# Altium schematic sheet HV_boost.SchDoc
size A4; DocumentNumber: 4; SheetNumber: 4; SheetTotal: 10
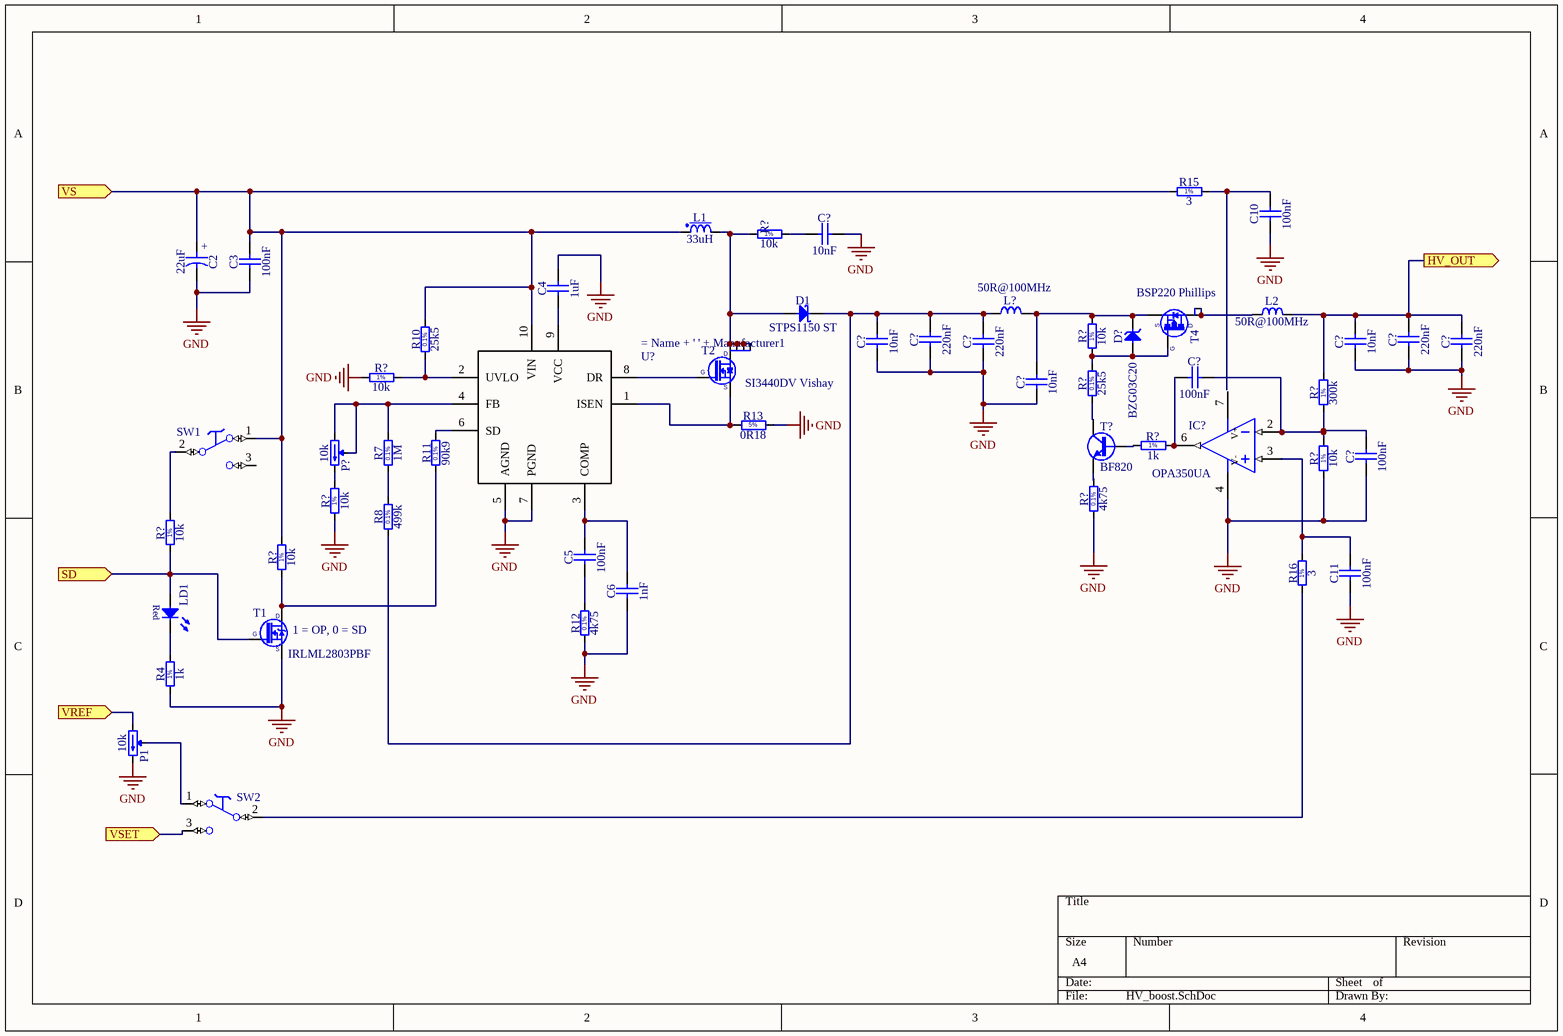
[diagram p0: HV_boost.SchDoc]

## Parts
(Parts that share a designator on the sheet are numbered #1, #2 ... from top to bottom, then left to right.)
=_Name_+_'_'_+_Manufacturer1  U?  [SOP50P490X110-10N]
C2  22uF  [CAPAE530X540N]
C3  100nF  [CAPC2012X135N]
C4  1uF  [CAPC2012X135N]
C5  100nF  [CAPC2012X135N]
C6  1nF  [CAPC2012X135N]
C10  100nF  [CAPC2012X135N]
C11  100nF  [CAPC2012X135N]
C?#1  10nF  [CAPC3216X100N]
C?#2  220nF  [CAPR500-350X720X850]
C?#3  220nF  [CAPR500-350X720X850]
C?#4  10nF  [CAPC3216X100N]
C?#5  220nF  [CAPR500-350X720X850]
C?#6  10nF  [CAPC3216X100N]
C?#7  220nF  [CAPR500-350X720X850]
C?#8  100nF  [CAPC2012X135N]
C?#9  10nF  [CAPC3216X100N]
C?#10  100nF  [CAPC2012X135N]
D1  STPS1150 ST  [DIOM5027X244N]
D?  BZG03C20  [DIOM5326X230N]
IC?  OPA350UA  [SOIC127P600X175-8N]
L1  33uH  [IND_PANASONIC_ELL6RH]
L2  50R@100MHz  [IND_MURATA_BLM31PG]
L?  50R@100MHz  [IND_MURATA_BLM31PG]
LD1  Super Red  [LED_OSRAM_LSR976]  (value not drawn)
P1  10k  [TRIM_BOURNS_3266W]
P?  10k  [TRIM_BOURNS_3266W]
R4  1k  [RESC2012X60N]
R7  1M  [RESC2012X60N]
R8  499k  [RESC2012X60N]
R10  25k5  [RESC2012X60N]
R11  90k9  [RESC2012X60N]
R12  4k75  [RESC2012X60N]
R13  0R18  [RESC2012X70N]
R15  3  [RESC2012X60N]
R16  3  [RESC2012X60N]
R?#1  10k  [RESC2012X60N]
R?#2  10k  [RESC2012X60N]
R?#3  10k  [RESC2012X60N]
R?#4  25k5  [RESC2012X60N]
R?#5  300k  [RESC2012X60N]
R?#6  1k  [RESC2012X60N]
R?#7  10k  [RESC2012X60N]
R?#8  10k  [RESC2012X60N]
R?#9  4k75  [RESC2012X60N]
R?#10  10k  [RESC2012X60N]
R?#11  10k  [RESC2012X60N]
SW1  Switch  [SW_TYCO_1-1437575-4]  (value not drawn)
SW2  Switch  [SW_TYCO_1-1437575-4]  (value not drawn)
T1  IRLML2803PBF  [SOT95P237X112-3N]
T2  SI3440DV Vishay  [SOT95P280X110-6N]
T4  BSP220 Phillips  [SOT230P700X175-4N]
T?  BF820  [SOT95P230X110-3N]

## Ports
HV_OUT (out), SD (in), VREF (in), VS (in), VSET (in)

## Nets
GND: =_Name_+_'_'_+_Manufacturer1.5(AGND) =_Name_+_'_'_+_Manufacturer1.7(PGND) C2.2 C3.1 C4.2 C6.1 C10.1 C11.1 C?#1.2 C?#2.1 C?#3.1 C?#4.1 C?#5.1 C?#6.1 C?#7.1 C?#9.1 C?#10.1 IC?.4(V-) P1.3(CW) R4.1 R12.1 R13.2 R?#3.1 R?#7.1 R?#8.1 R?#9.1 T1.2(S)
HV_OUT: C?#3.2 C?#6.2 C?#7.2 L2.2 R?#5.2 ; port HV_OUT
SD: LD1.2(A) R?#10.1 T1.1(G) ; port SD
VREF: P1.1(CCW) ; port VREF
VS: =_Name_+_'_'_+_Manufacturer1.10(VIN) C2.1 C3.2 L1.1 R10.2 R15.1 R?#11.2 SW1.1(NC) ; port VS
VSET: SW2.3(NO) ; port VSET
Net=_Name_+_'_'_+_Manufacturer1_1: =_Name_+_'_'_+_Manufacturer1.1(ISEN) R13.1 T2.4(S)
Net=_Name_+_'_'_+_Manufacturer1_2: =_Name_+_'_'_+_Manufacturer1.2(UVLO) R10.1 R?#3.2
Net=_Name_+_'_'_+_Manufacturer1_3: =_Name_+_'_'_+_Manufacturer1.3(COMP) C5.2 C6.2
Net=_Name_+_'_'_+_Manufacturer1_4: =_Name_+_'_'_+_Manufacturer1.4(FB) P?.1(CCW) P?.2(W) R7.2
Net=_Name_+_'_'_+_Manufacturer1_6: =_Name_+_'_'_+_Manufacturer1.6(SD) R11.2
Net=_Name_+_'_'_+_Manufacturer1_8: =_Name_+_'_'_+_Manufacturer1.8(DR) T2.3(G)
Net=_Name_+_'_'_+_Manufacturer1_9: =_Name_+_'_'_+_Manufacturer1.9(VCC) C4.1
NetC5_1: C5.1 R12.2
NetC10_2: C10.2 R15.2
NetC11_2: C11.2 IC?.3(IN+) R16.2
NetC?#1_1: C?#1.1 R?#1.2
NetC?#2_2: C?#2.2 C?#4.2 C?#5.2 D1.1(C) L?.1 R8.1
NetC?#8_1: C?#8.1 IC?.6(OUT) R?#6.2
NetC?#8_2: C?#8.2 C?#10.2 IC?.2(IN-) R?#5.1 R?#7.2
NetC?#9_2: C?#9.2 D?.1(C) L?.2 R?#2.2 T4.3(S)
NetD1_2: D1.2(A) L1.2 R?#1.1 T2.1(D) T2.2(D) T2.5(D) T2.6(D)
NetD?_2: D?.2(A) R?#2.1 R?#4.2 T4.1(G)
NetL2_1: L2.1 T4.2(D) T4.4(D)
NetLD1_1: LD1.1(C) R4.2
NetP1_2: P1.2(W) SW2.1(NC)
NetP?_3: P?.3(CW) R?#8.2
NetR7_1: R7.1 R8.2
NetR11_1: R11.1 R?#11.1 T1.3(D)
NetR16_1: R16.1 SW2.2(C)
NetR?#4_1: R?#4.1 T?.3(C)
NetR?#6_1: R?#6.1 T?.1(B)
NetR?#9_2: R?#9.2 T?.2(E)
NetR?#10_2: R?#10.2 SW1.2(C)

Not connected (* = marked no-connect by the designer): IC? 7(V+); SW1 3(NO)

## Notes on the sheet
- (near T1) 1 = OP, 0 = SD
- (in symbol CAE530-540_22UF_16V_20%) +
- (in symbol LED_OSRAM_LSR976) Red
- (in symbol R0805_0R18_5%_0.25W_250PPM_PANASONIC_ERJ) 5%
- (in symbol R0805_1K_1%_0.33W_100PPM_VISHAY_CRCW-HP) 1%
- (in symbol R0805_1M_0.1%_0.1W_25PPM) 0.1%
- (in symbol R0805_3R_1%_0.125W_200PPM) 1%
- (in symbol R0805_4K75_0.1%_0.1W_10PPM) 0.1%
- (in symbol R0805_10K_1%_0.125W_100PPM) 1%
- (in symbol R0805_25K5_0.1%_0.1W_10PPM) 0.1%
- (in symbol R0805_90K9_0.1%_0.1W_10PPM) 0.1%
- (in symbol R0805_300K_1%_0.125W_100PPM) 1%
- (in symbol R0805_499K_0.1%_0.25W_25PPM_150V) 0.1%

## Library data of the parts
=_Name_+_'_'_+_Manufacturer1 = LM3418: Manufacutrer: TI; Name: LM3418
C2 = CAE530-540_22UF_16V_20%: Polarised capacitor; Part Description: Aluminum Electrolytic SMT Capacitor; Manufacturer: PANASONIC; Manufacturer Part Number: EEEFK1C220AR; Voltage: 16V; Tolerance: ±20%; Part Number: CAE530-540_22UF_16V_20%; Component Kind: Standard; Component Type: Standard; Pin Count: 2; Value: 22uF; Status: Not Recommended; Case: B; Mounted: Yes; Socket: No; SMD: Yes; Sense: No; ComponentHeight: 5.8mm; HelpURL: \\cern.ch\dfs\Applications\Altium\Datasheets\CAE_PANASONIC_FK.pdf; Author: CERN DEM JLC; CreateDate: 03.12.2007; LatestRevisionDate: 05.11.2014
C3 C5 C10 C11 C?#8 C?#10 = CC0805_100NF_50V_10%_X7R: Non-polarised capacitor; Part Description: SMD Multilayer Chip Ceramic Capacitor; Manufacturer: GENERIC; Manufacturer1 Part Number: C2012X7R1H104K085AA; Voltage: 50V; TC: X7R; Tolerance: ±10%; Part Number: CC0805_100NF_50V_10%_X7R; Component Kind: Standard; Component Type: Standard; Pin Count: 2; Value: 100nF; Status: Preferred; Manufacturer Part Number: CC0805_100NF_50V_10%_X7R; Case: 0805; Mounted: Yes; Socket: No; SMD: Yes; Sense: No; Manufacturer1 Example: TDK; Manufacturer1 ComponentHeight: 1mm; HelpURL: \\cern.ch\dfs\Applications\Altium\Datasheets\CC0805_X7R_TDK_C.pdf; Author: CERN DEM JLC; CreateDate: 03.12.2007; LatestRevisionDate: 22.04.2015
C4 = CC0805_1UF_16V_10%_X7R: Non-polarised capacitor; Part Description: SMD Multilayer Chip Ceramic Capacitor; Manufacturer: GENERIC; Manufacturer1 Part Number: C2012X7R1C105K125AA; Voltage: 16V; TC: X7R; Tolerance: ±10%; Part Number: CC0805_1UF_16V_10%_X7R; Component Kind: Standard; Component Type: Standard; Pin Count: 2; Value: 1uF; Status: Preferred; Manufacturer Part Number: CC0805_1UF_16V_10%_X7R; Case: 0805; Mounted: Yes; Socket: No; SMD: Yes; Sense: No; Manufacturer1 Example: TDK; Manufacturer1 ComponentHeight: 1.45mm; HelpURL: \\cern.ch\dfs\Applications\Altium\Datasheets\CC0805_X7R_TDK_C.pdf; Author: CERN DEM JLC; CreateDate: 03.12.2007; LatestRevisionDate: 22.04.2015
C6 = CC0805_1NF_50V_10%_X7R: Non-polarised capacitor; Part Description: SMD Multilayer Chip Ceramic Capacitor; Manufacturer: GENERIC; Manufacturer1 Part Number: 223858015623; Voltage: 50V; TC: X7R; Tolerance: ±10%; Part Number: CC0805_1NF_50V_10%_X7R; Component Kind: Standard; Component Type: Standard; Pin Count: 2; Value: 1nF; Status: Preferred; Manufacturer Part Number: CC0805_1NF_50V_10%_X7R; Case: 0805; Mounted: Yes; Socket: No; SMD: Yes; Sense: No; Manufacturer1 Example: PHYCOMP; Manufacturer1 ComponentHeight: 1.35mm; HelpURL: \\cern.ch\dfs\Applications\Altium\Datasheets\CC0805_X7R_PHYCOMP.pdf; Author: CERN DEM JLC; CreateDate: 03.12.2007; LatestRevisionDate: 22.04.2015
C?#1 C?#4 C?#6 C?#9 = CC1206_10NF_200V_5%_C0G: Non-polarised capacitor; Part Description: SMD Multilayer Chip Ceramic Capacitor; Manufacturer: GENERIC; Manufacturer1 Part Number: C1206C103J2GACAUTO; Voltage: 200V; TC: C0G/NP0; Tolerance: ±5%; Part Number: CC1206_10NF_200V_5%_C0G; Component Kind: Standard; Component Type: Standard; Pin Count: 2; Value: 10nF; Status: Preferred; Manufacturer Part Number: CC1206_10NF_200V_5%_C0G; Case: 1206; Mounted: Yes; Socket: No; SMD: Yes; Sense: No; Manufacturer1 Example: KEMET; Manufacturer1 ComponentHeight: 1.0mm; HelpURL: \\cern.ch\dfs\Applications\Altium\Datasheets\CC1206_C0G_KEMET.pdf; Author: CERN DEM JLC; CreateDate: 25.11.2014; LatestRevisionDate: 25.11.2014
C?#2 C?#3 C?#5 C?#7 = CPER_220NF_100V_10%_500-350X720X850: Non-polarised capacitor; Part Description: Metallized Polyester Film Capacitor (MKS2); Manufacturer: WIMA; Manufacturer Part Number: MKS2D032201C00KSSD; Voltage: 100VDC/63VAC; Tolerance: ±10%; Part Number: CPER_220NF_100V_10%_500-350X720X850; Component Kind: Standard; Component Type: Standard; Pin Count: 2; Value: 220nF; Status: None; Case: LS5 W3.5 x L7.2 x H8.5; Mounted: Yes; Socket: No; SMD: No; Sense: No; ComponentHeight: 8.5mm; HelpURL: \\cern.ch\dfs\Applications\Altium\Datasheets\CPER_WIMA_MKS2.pdf; Author: CERN DEM JLC; CreateDate: 22.03.2010; LatestRevisionDate: 30.01.2012
D1 = STPS1150: Diode Schottky  Anode Pin 1 Cathode Pin 3 (Pas de pin 2); Name: STPS1150; Manufacturer: ST
D? = BZG03C20: Zener Diode; Part Description: Voltage Regulator Diode; Manufacturer: VISHAY SEMICONDUCTOR; Voltage: 20V; Power: 1.25W; PressFit: No; Bonding: No; Part Number: BZG03C20; Component Kind: Standard; Component Type: Standard; Device: BZG03C20; PackageDescription: DO-214-AC/SMA Molded Diode, Body 5.3x2.6mm, IPC Medium Density; Manufacturer Part Number: BZG03C20; Pin Count: 2; Case: DO-214AC; Mounted: Yes; Socket: No; SMD: Yes; Sense: No; ComponentHeight: 2.3mm; HelpURL: \\cern.ch\dfs\Applications\Altium\Datasheets\BZG03C.pdf; Author: CERN DEM JLC; CreateDate: 02.06.2008; LatestRevisionDate: 02.06.2008
IC? = OPA350UA: Operational Amplifier; Part Description: High-Speed, Single-Supply, Rail-to-Rail Operational Amplifier; Manufacturer: TEXAS INSTRUMENTS; PressFit: No; Bonding: No; Part Number: OPA350UA; Component Kind: Standard; Component Type: Standard; Device: OPA350UA; PackageDescription: SOIC 8, Pitch 1.27mm - Body 4x5mm, IPC Medium Density; Manufacturer Part Number: OPA350UA; Pin Count: 5; Case: SOIC8; Mounted: Yes; Socket: No; SMD: Yes; Sense: No; ComponentHeight: 1.75mm; Author: CERN DEM JLC; HelpURL: \\cern.ch\dfs\Applications\Altium\Datasheets\OPA350UA.pdf; CreateDate: 11.10.2012; LatestRevisionDate: 11.10.2012
L1 = IND_33UH_20%_PANASONIC_ELL6RH330M: Inductor With Magnetic core 1Dot; Part Description: SMD Choke Coil; Power: 600mA; Resistance: 0.38R; Tolerance: ±20%; Part Number: IND_33UH_20%_PANASONIC_ELL6RH330M; Component Kind: Standard; Component Type: Standard; Pin Count: 2; Value: 33uH; Status: None; Manufacturer: PANASONIC; Manufacturer Part Number: ELL6RH330M; Mounted: Yes; Socket: No; SMD: Yes; Sense: No; ComponentHeight: 2.8mm; HelpURL: \\cern.ch\dfs\Applications\Altium\Datasheets\IND_PANASONIC_ELL6RH.pdf; Author: CERN DEM JMW; CreateDate: 09.01.2009; LatestRevisionDate: 09.01.2009
L2 L? = IND1206_MURATA_BLM31PG500SN1: Inductor; Part Description: SMD EMIFIL Chip Ferrite Bead; Manufacturer: MURATA; Power: 3.5A; Resistance: 0.015R; Part Number: IND1206_MURATA_BLM31PG500SN1; Component Kind: Standard; Component Type: Standard; Pin Count: 2; Value: 50R@100MHz; Status: None; Manufacturer Part Number: BLM31PG500SN1; Case: 1206; Mounted: Yes; Socket: No; SMD: Yes; Sense: No; ComponentHeight: 1.3mm; HelpURL: \\cern.ch\dfs\Applications\Altium\Datasheets\IND1206_MURATA_BLM31P.pdf; Author: CERN DEM JLC; CreateDate: 05.12.2013; LatestRevisionDate: 05.12.2013
LD1 = LED_OSRAM_LSR976: LED Red 1C 2A; Part Description: Surface Mount Super Red LED (0805 Case); Manufacturer: OSRAM; Manufacturer Part Number: LSR976; PressFit: No; Bonding: No; Part Number: LED_OSRAM_LSR976; Component Kind: Standard; Component Type: Standard; Color: Super Red; PackageDescription: Super Red Chip LED, 2-Leads, Body 2 x1.25mm, IPC Medium Density; Pin Count: 2; Case: 0805; Mounted: Yes; Socket: No; SMD: Yes; Sense: No; ComponentHeight: 0.9mm; HelpURL: \\cern.ch\dfs\Applications\Altium\Datasheets\LED_OSRAM_LSR976.pdf; Author: CERN DEM JLC; CreateDate: 18.05.2010; LatestRevisionDate: 18.05.2010
P1 P? = TRIM_12T_10K_BOURNS_3266W-1-103LF: Trimming Potentiometer; Part Description: 12 Turn Trimming Potentiometer (Top Adjustement); Manufacturer: BOURNS; Power: 0.25W; TC: ±100ppm/°C; Tolerance: ±10%; PressFit: No; Part Number: TRIM_12T_10K_BOURNS_3266W-1-103LF; Component Kind: Standard; Component Type: Standard; Pin Count: 3; Value: 10k; Manufacturer Part Number: 3266W-1-103LF; Case: 3266W; Mounted: Yes; Socket: No; SMD: No; Sense: No; ComponentHeight: 7.75mm; HelpURL: \\cern.ch\dfs\Applications\Altium\Datasheets\TRIM_BOURNS_3266W.pdf; Author: CERN DEM JLC; CreateDate: 10.06.2008; LatestRevisionDate: 28.11.2012
R4 R?#6 = R0805_1K_1%_0.33W_100PPM_VISHAY_CRCW-HP: Resistor - 1%; Part Description: 150V, Pulse Proof, High Power Thick Film Chip Resistor; Manufacturer: VISHAY DRALORIC; Manufacturer Part Number: CRCW08051K00FKEAHP; Power: 0.33W; TC: ±100ppm/°C; PressFit: No; Part Number: R0805_1K_1%_0.33W_100PPM_VISHAY_CRCW-HP; Component Kind: Standard; Component Type: Standard; Pin Count: 2; Value: 1k; Status: None; Tolerance: ±1%; Case: 0805; Mounted: Yes; Sense: No; Socket: No; SMD: Yes; Manufacturer1 ComponentHeight: 0.6mm; HelpURL: \\cern.ch\dfs\Applications\Altium\Datasheets\R0805_VISHAY_CRCW-HP e3.pdf; Author: CERN DEM JLC; CreateDate: 16.06.2010; LatestRevisionDate: 16.06.2010
R7 = R0805_1M_0.1%_0.1W_25PPM: Resistor - 0.1%; Part Description: Precision Surface Mount Resistor; Manufacturer: GENERIC; Manufacturer1 Part Number: PCF0805R-1M0BT1; Power: 0.1W; TC: ±25ppm/°C; PressFit: No; Part Number: R0805_1M_0.1%_0.1W_25PPM; Component Kind: Standard; Component Type: Standard; Pin Count: 2; Value: 1M; Status: Not Recommended; Tolerance: ±0.1%; Manufacturer Part Number: R0805_1M_0.1%_0.1W_25PPM; Case: 0805; Mounted: Yes; Sense: No; Socket: No; SMD: Yes; Manufacturer1 Example: WELWYN COMPONENTS; HelpURL: \\cern.ch\dfs\Applications\Altium\Datasheets\R0805_WELWYN_PCF0805R.pdf; Author: CERN DEM JLC; CreateDate: 17.11.2008; LatestRevisionDate: 26.04.2010
R8 = R0805_499K_0.1%_0.25W_25PPM_150V: Resistor - 0.1%; Part Description: Thin Film Chip Resistor; Manufacturer: GENERIC; Manufacturer1 Part Number: RP73PF2A499KBTDF; Power: 0.25W; TC: ±25ppm/°C; Voltage: 150V; PressFit: No; Part Number: R0805_499K_0.1%_0.25W_25PPM_150V; Component Kind: Standard; Component Type: Standard; Pin Count: 2; Value: 499k; Status: None; Tolerance: ±0.1%; Manufacturer Part Number: R0805_499K_0.1%_0.25W_25PPM_150V; Case: 0805; Mounted: Yes; Sense: No; Socket: No; SMD: Yes; Manufacturer1 Example: TYCO ELECTRONICS; Manufacturer1 ComponentHeight: 0.65mm; HelpURL: \\cern.ch\dfs\Applications\Altium\Datasheets\R0805_TYCO_RP73.pdf; Author: CERN DEM BC; CreateDate: 04.12.2015; LatestRevisionDate: 04.12.2015
R10 R?#4 = R0805_25K5_0.1%_0.1W_10PPM: Resistor - 0.1%; Part Description: Thin Film Chip Resistor; Manufacturer: GENERIC; Manufacturer1 Part Number: RN73C2A25K5BTG; Power: 0.1W; TC: ±10ppm; PressFit: No; Part Number: R0805_25K5_0.1%_0.1W_10PPM; Component Kind: Standard; Component Type: Standard; Pin Count: 2; Value: 25k5; Status: Not Recommended; Tolerance: ±0.1%; Manufacturer Part Number: R0805_25K5_0.1%_0.1W_10PPM; Case: 0805; Mounted: Yes; Sense: No; Socket: No; SMD: Yes; Manufacturer1 Example: TYCO HOLSWORTHY; Manufacturer1 ComponentHeight: 0.6mm; HelpURL: \\cern.ch\dfs\Applications\Altium\Datasheets\R0805_Tyco_RN73.pdf; Author: CERN DEM JLC; CreateDate: 03.12.2007; LatestRevisionDate: 13.03.2008
R11 = R0805_90K9_0.1%_0.1W_10PPM: Resistor - 0.1%; Part Description: Thin Film Chip Resistor; Manufacturer: GENERIC; Manufacturer1 Part Number: RN73C2A90K9BTG; Power: 0.1W; TC: ±10ppm; PressFit: No; Part Number: R0805_90K9_0.1%_0.1W_10PPM; Component Kind: Standard; Component Type: Standard; Pin Count: 2; Value: 90k9; Status: Not Recommended; Tolerance: ±0.1%; Manufacturer Part Number: R0805_90K9_0.1%_0.1W_10PPM; Case: 0805; Mounted: Yes; Sense: No; Socket: No; SMD: Yes; Manufacturer1 Example: TYCO HOLSWORTHY; Manufacturer1 ComponentHeight: 0.6mm; HelpURL: \\cern.ch\dfs\Applications\Altium\Datasheets\R0805_Tyco_RN73.pdf; Author: CERN DEM JLC; CreateDate: 03.12.2007; LatestRevisionDate: 13.03.2008
R12 R?#9 = R0805_4K75_0.1%_0.1W_10PPM: Resistor - 0.1%; Part Description: Thin Film Chip Resistor; Manufacturer: GENERIC; Manufacturer1 Part Number: RN73C2A4K75BTG; Power: 0.1W; TC: ±10ppm; PressFit: No; Part Number: R0805_4K75_0.1%_0.1W_10PPM; Component Kind: Standard; Component Type: Standard; Pin Count: 2; Value: 4k75; Status: Not Recommended; Tolerance: ±0.1%; Manufacturer Part Number: R0805_4K75_0.1%_0.1W_10PPM; Case: 0805; Mounted: Yes; Sense: No; Socket: No; SMD: Yes; Manufacturer1 Example: TYCO HOLSWORTHY; Manufacturer1 ComponentHeight: 0.6mm; HelpURL: \\cern.ch\dfs\Applications\Altium\Datasheets\R0805_Tyco_RN73.pdf; Author: CERN DEM JLC; CreateDate: 03.12.2007; LatestRevisionDate: 13.03.2008
R13 = R0805_0R18_5%_0.25W_250PPM_PANASONIC_ERJ: Resistor - 5%; Part Description: Low Resistance Thick Film Chip Resistor; Manufacturer Part Number: ERJ6BSJR18V; Power: 0.25W; TC: ±250ppm/°C; PressFit: No; Part Number: R0805_0R18_5%_0.25W_250PPM_PANASONIC_ERJ; Component Kind: Standard; Component Type: Standard; Pin Count: 2; Value: 0R18; Status: Not Recommended; Tolerance: ±5%; Manufacturer: PANASONIC; Case: 0805; Mounted: Yes; Sense: No; Socket: No; SMD: Yes; ComponentHeight: 0.7mm; HelpURL: \\cern.ch\dfs\Applications\Altium\Datasheets\R0805_PANASONIC_ERJ.pdf; Author: CERN DEM JLC; CreateDate: 22.06.2011; LatestRevisionDate: 22.06.2011
R15 R16 = R0805_3R_1%_0.125W_200PPM: Resistor - 1%; Part Description: General Purpose Thick Film Chip Resistor; Manufacturer: GENERIC; Manufacturer1 Part Number: 232273463008L or RC0805FR-073RL; Power: 0.125W; TC: ±200ppm/°C; PressFit: No; Part Number: R0805_3R_1%_0.125W_200PPM; Component Kind: Standard; Component Type: Standard; Pin Count: 2; Value: 3; Status: Preferred; Tolerance: ±1%; Manufacturer Part Number: R0805_3R_1%_0.125W_200PPM; Case: 0805; Mounted: Yes; Sense: No; Socket: No; SMD: Yes; Manufacturer1 Example: YAGEO PHYCOMP; Manufacturer1 ComponentHeight: 0.65mm; HelpURL: \\cern.ch\dfs\Applications\Altium\Datasheets\R0805_Phycomp_RC0805.pdf; Author: CERN DEM JLC; CreateDate: 03.12.2007; LatestRevisionDate: 17.10.2012
R?#1-R?#3 R?#7 R?#8 R?#10 R?#11 = R0805_10K_1%_0.125W_100PPM: Resistor - 1%; Part Description: General Purpose Thick Film Chip Resistor; Manufacturer: GENERIC; Manufacturer1 Part Number: NRC10F1002TRF; Power: 0.125W; TC: ±100ppm/°C; PressFit: No; Part Number: R0805_10K_1%_0.125W_100PPM; Component Kind: Standard; Component Type: Standard; Pin Count: 2; Value: 10k; Status: Preferred; Tolerance: ±1%; Manufacturer Part Number: R0805_10K_1%_0.125W_100PPM; Case: 0805; Mounted: Yes; Sense: No; Socket: No; SMD: Yes; Manufacturer1 Example: NIC COMPONENT; Manufacturer1 ComponentHeight: 0.6mm; HelpURL: \\cern.ch\dfs\Applications\Altium\Datasheets\R0805_NIC_NRC.pdf; Author: CERN DEM JLC; CreateDate: 03.12.2007; LatestRevisionDate: 13.03.2008
R?#5 = R0805_300K_1%_0.125W_100PPM: Resistor - 1%; Part Description: General Purpose Thick Film Chip Resistor; Manufacturer: GENERIC; Manufacturer1 Part Number: NRC10F3003TRF; Power: 0.125W; TC: ±100ppm/°C; PressFit: No; Part Number: R0805_300K_1%_0.125W_100PPM; Component Kind: Standard; Component Type: Standard; Pin Count: 2; Value: 300k; Status: Preferred; Tolerance: ±1%; Manufacturer Part Number: R0805_300K_1%_0.125W_100PPM; Case: 0805; Mounted: Yes; Sense: No; Socket: No; SMD: Yes; Manufacturer1 Example: NIC COMPONENT; Manufacturer1 ComponentHeight: 0.6mm; HelpURL: \\cern.ch\dfs\Applications\Altium\Datasheets\R0805_NIC_NRC.pdf; Author: CERN DEM JLC; CreateDate: 03.12.2007; LatestRevisionDate: 13.03.2008
SW1 SW2 = SW_TYCO_1-1437575-4: SPDT Switch; Part Description: 30VDC, 100mA, Slide Low Profile SPDT Switch, SSA Series; Manufacturer: TYCO; Manufacturer Part Number: 1-1437575-4 or SSA-12; PressFit: No; Part Number: SW_TYCO_1-1437575-4; Component Kind: Standard; Component Type: Standard; Pin Count: 3; PackageDescription: Body 8.79 x 3.4mm, Slide Low Profile SPDT Switch, SSA Series; Family: Switch; Mounted: Yes; Socket: No; SMD: No; Sense: No; Status: None; ComponentHeight: 5.4mm; HelpURL: \\cern.ch\dfs\Applications\Altium\Datasheets\SW_TYCO_1-1437575-4.pdf; Author: CERN DEM JLC; CreateDate: 11.11.2013; LatestRevisionDate: 11.11.2013
T1 = IRLML2803PBF: N-CHANNEL MOSFET WITH ZENER DIODE; Part Description: 30V 1.2A  N-Channel HEXFET® Power MOSFET; Manufacturer: INTERNATIONAL RECTIFIER; PressFit: No; Bonding: No; Part Number: IRLML2803PBF; Component Kind: Standard; Component Type: Standard; Device: IRLML2803PBF; PackageDescription: SOT, 0.95mm, pitch; 3 pin,1.30mm W X 2.92mm L X 1.12mm H body, IPC Medium Density; Manufacturer Part Number: IRLML2803PBF; Pin Count: 3; Case: SOT23-3; Mounted: Yes; Socket: No; SMD: Yes; Sense: No; ComponentHeight: 1.12mm; HelpURL: \\cern.ch\dfs\Applications\Altium\Datasheets\IRLML2803PBF.pdf; Author: CERN DEM JMW; CreateDate: 08.12.2010; LatestRevisionDate: 08.12.2010
T2 = SI3440DV: N-Channel MOSFET; Name: SI3440DV; Manufacturer: Vishay
T4 = BSP220: P-Channel MOSFET; Name: BSP220; Manufacturer: Phillips
T? = BF820: NPN Transistor; Part Description: 300V 50mA NPN High-Voltage Transistor; Manufacturer: NXP SEMICONDUCTORS; PressFit: No; Bonding: No; Part Number: BF820; Component Kind: Standard; Component Type: Standard; Device: BF820; PackageDescription: SOT23, 3 pin, Pitch 0.95mm - 1.3mm W X 2.9mm L X 1.1mm H, IPC Medium Density; Manufacturer Part Number: BF820; Pin Count: 3; Case: SOT23-3; Mounted: Yes; Socket: No; SMD: Yes; Sense: No; ComponentHeight: 1.1mm; HelpURL: \\cern.ch\dfs\Applications\Altium\Datasheets\BF820.pdf; Author: CERN DEM JLC; CreateDate: 23.09.2014; LatestRevisionDate: 23.09.2014